# Altium schematic sheet power.SchDoc: Project Title
size A3; ApprovedBy: Yves Chevallier; CheckedBy: Yves Chevallier; Author: Yves Chevallier; CompanyName: EPFL; DrawnBy: Yves Chevallier; Engineer: Yves Chevallier; Organization: EPFL; Address1: EPFL; Address2: CH1015 Lausanne; Address3: +41(0)21 693 36 98; Address4: +41(0)21 693 26 00; DocumentNumber: ABC.00.0000.000.0; Revision: v1.0; SheetNumber: 0; SheetTotal: 0; DrawnByDate: 2000-01-01; ExecutionWarrantDate: 2000-01-01; ExecutionWarrant: Yves Chevallier; Context: Confidential; PageSetup: Record=PageOptions|CenterHorizontal=True|CenterVertical=False|PrintScale=0.97|XCorrection=1.00|YCorrection=1.00|PrintKind=0|BorderSize=5000000|LeftOffset=0|BottomOffset=0|Orientation=2|PaperLength=1000|PaperWidth=1000|Scale=100|PaperSource=262|PrintQuality=600|MediaType=1|DitherType=10|PaperKind=A4|PrintScaleMode=1; EngineerDate: 2000-01-01; CheckedByDate: 2000-01-01; ProjectName: PRJ
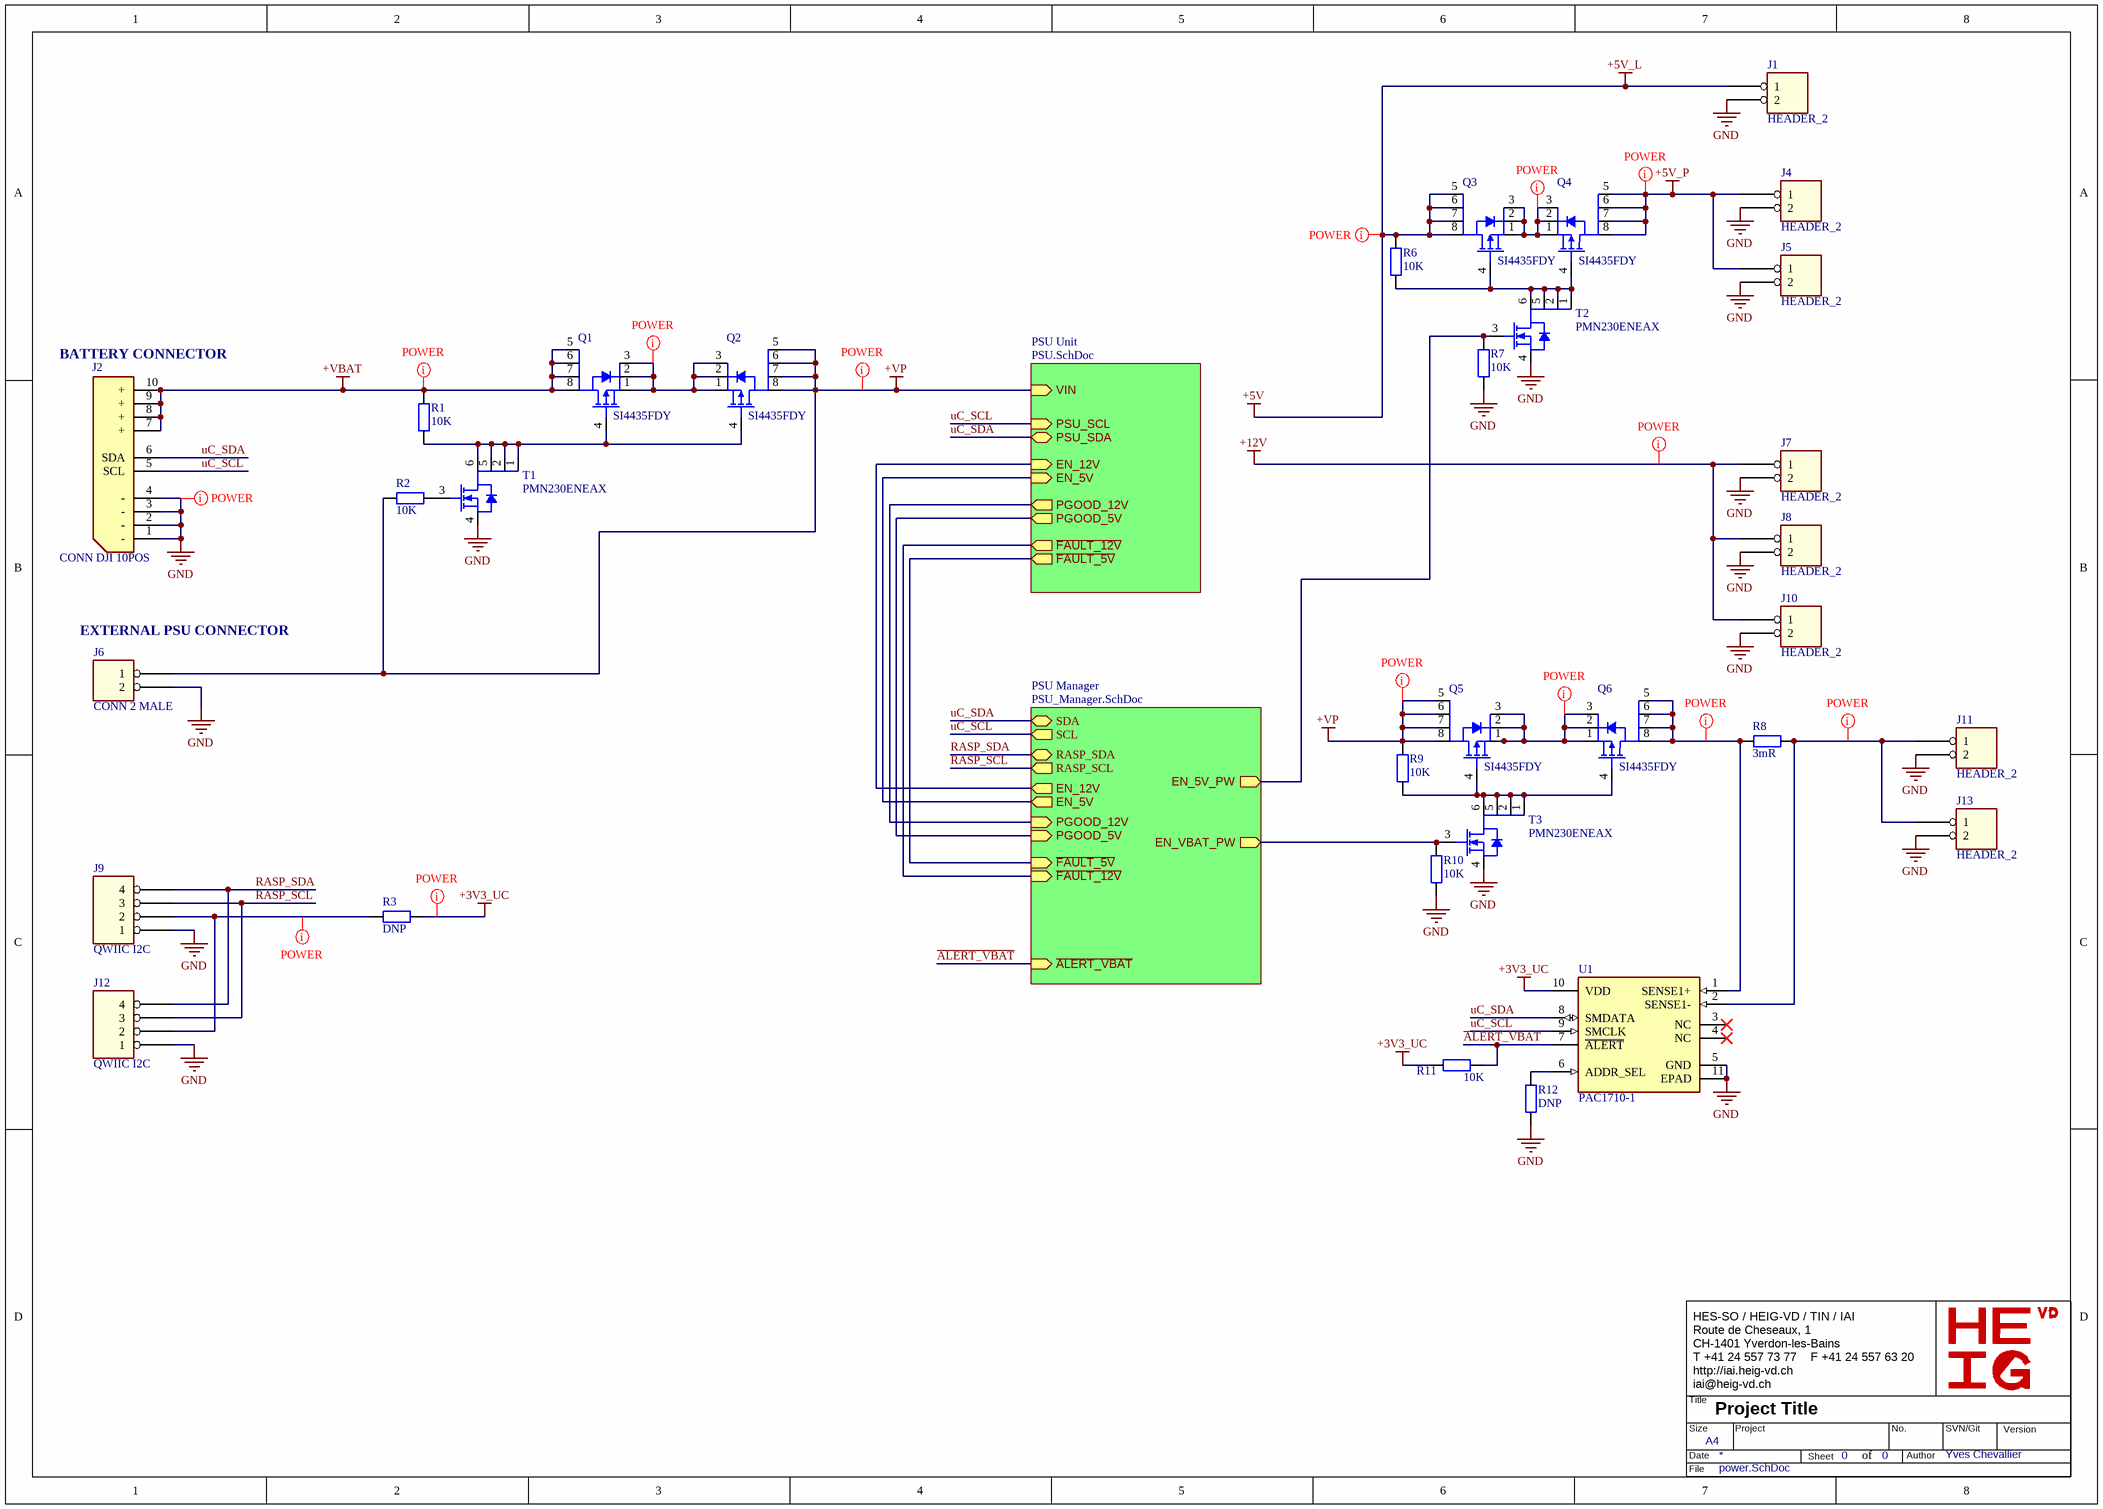
[diagram p0: power.SchDoc]

## Parts
J1  HEADER_2  [PHOENIX MKDS 5/2-6,35 - 1714955]
J2  CONN DJI 10POS  [DJI Battery Connector]
J4  HEADER_2  [PHOENIX MKDS 5/2-6,35 - 1714955]
J5  HEADER_2  [PHOENIX MKDS 5/2-6,35 - 1714955]
J6  CONN 2 MALE  [PHOENIX MKDS 5/2-6,35 - 1714955]
J7  HEADER_2  [PHOENIX MKDS 5/2-6,35 - 1714955]
J8  HEADER_2  [PHOENIX MKDS 5/2-6,35 - 1714955]
J9  QWIIC I2C  [JST_SM04B-SRSS-TB(LF)(SN)]
J10  HEADER_2  [PHOENIX MKDS 5/2-6,35 - 1714955]
J11  HEADER_2  [PHOENIX MKDS 5/2-6,35 - 1714955]
J12  QWIIC I2C  [JST_SM04B-SRSS-TB(LF)(SN)]
J13  HEADER_2  [PHOENIX MKDS 5/2-6,35 - 1714955]
Q1  SI4435FDY  [SOIC-8 - N]
Q2  SI4435FDY  [SOIC-8 - N]
Q3  SI4435FDY  [SOIC-8 - N]
Q4  SI4435FDY  [SOIC-8 - N]
Q5  SI4435FDY  [SOIC-8 - N]
Q6  SI4435FDY  [SOIC-8 - N]
R1  10K  [SM/R_0603]
R2  10K  [SM/R_0603]
R3  DNP  [SM/R_0603]  (no BOM)
R6  10K  [SM/R_0603]
R7  10K  [SM/R_0603]
R8  3mR  [SM/R_1210]
R9  10K  [SM/R_0603]
R10  10K  [SM/R_0603]
R11  10K  [SM/R_0603]
R12  DNP  [SM/R_0603]  (no BOM)
T1  PMN230ENEAX  [TSOP-6]
T2  PMN230ENEAX  [TSOP-6]
T3  PMN230ENEAX  [TSOP-6]
U1  PAC1710-1  [WFDFN-10]

## Sub-sheets
PSU Manager = PSU_Manager.SchDoc: SDA (bidir), SCL (out), EN_5V (out), PGOOD_12V (in), PGOOD_5V (in), EN_12V (out), ~{FAULT_12V} (in), ~{FAULT_5V} (in), EN_VBAT_PW (out), EN_5V_PW (out), ~{ALERT_VBAT} (in), RASP_SDA (bidir), RASP_SCL (out)
PSU Unit = PSU.SchDoc: VIN (in), PSU_SCL (in), EN_5V (in), PGOOD_12V (out), PSU_SDA (bidir), PGOOD_5V (out), EN_12V (in), ~{FAULT_12V} (out), ~{FAULT_5V} (out)

## Nets
+3V3_UC: R3.1 R11.1 U1.10(VDD)
+5V: J1.1 Q3.5(D) Q3.6(D) Q3.7(D) Q3.8(D) R6.1  [also labelled +5V_L]
+5V_P: J4.1 J5.1 Q4.5(D) Q4.6(D) Q4.7(D) Q4.8(D)
+12V: J7.1 J8.1 J10.1
+VBAT: J2.7(+) J2.8(+) J2.9(+) J2.10(+) Q1.5(D) Q1.6(D) Q1.7(D) Q1.8(D) R1.1
+VP: J6.1 Q2.5(D) Q2.6(D) Q2.7(D) Q2.8(D) Q5.5(D) Q5.6(D) Q5.7(D) Q5.8(D) R2.1 R9.1 ; sheet PSU Unit/VIN
GND: J1.2 J2.1(-) J2.2(-) J2.3(-) J2.4(-) J4.2 J5.2 J6.2 J7.2 J8.2 J9.1 J10.2 J11.2 J12.1 J13.2 R7.1 R10.1 R12.2 T1.4(S) T2.4(S) T3.4(S) U1.5(GND) U1.11(EPAD)
~{ALERT_VBAT}: R11.2 U1.7(~{ALERT}) ; sheet PSU Manager/~{ALERT_VBAT}
RASP_SCL: J9.3 J12.3 ; sheet PSU Manager/RASP_SCL
RASP_SDA: J9.4 J12.4 ; sheet PSU Manager/RASP_SDA
uC_SCL: J2.5(SCL) U1.9(SMCLK) ; sheet PSU Unit/PSU_SCL, sheet PSU Manager/SCL
uC_SDA: J2.6(SDA) U1.8(SMDATA) ; sheet PSU Unit/PSU_SDA, sheet PSU Manager/SDA
NetJ9_2: J9.2 J12.2 R3.2
NetJ11_1: J11.1 J13.1 R8.2 U1.2(SENSE1-)
NetQ1_1: Q1.1(S) Q1.2(S) Q1.3(S) Q2.1(S) Q2.2(S) Q2.3(S)
NetQ1_4: Q1.4(G) Q2.4(G) R1.2 T1.1(D) T1.2(D) T1.5(D) T1.6(D)
NetQ3_1: Q3.1(S) Q3.2(S) Q3.3(S) Q4.1(S) Q4.2(S) Q4.3(S)
NetQ3_4: Q3.4(G) Q4.4(G) R6.2 T2.1(D) T2.2(D) T2.5(D) T2.6(D)
NetQ5_1: Q5.1(S) Q5.2(S) Q5.3(S) Q6.1(S) Q6.2(S) Q6.3(S)
NetQ5_4: Q5.4(G) Q6.4(G) R9.2 T3.1(D) T3.2(D) T3.5(D) T3.6(D)
NetQ6_5: Q6.5(D) Q6.6(D) Q6.7(D) Q6.8(D) R8.1 U1.1(SENSE1+)
NetR2_2: R2.2 T1.3(G)
NetR7_2: R7.2 T2.3(G) ; sheet PSU Manager/EN_5V_PW
NetR10_2: R10.2 T3.3(G) ; sheet PSU Manager/EN_VBAT_PW
NetR12_1: R12.1 U1.6(ADDR_SEL)
(unnamed): sheet PSU Unit/EN_5V, sheet PSU Manager/EN_5V
(unnamed): sheet PSU Unit/PGOOD_12V, sheet PSU Manager/PGOOD_12V
(unnamed): sheet PSU Unit/PGOOD_5V, sheet PSU Manager/PGOOD_5V
(unnamed): sheet PSU Unit/EN_12V, sheet PSU Manager/EN_12V
(unnamed): sheet PSU Unit/~{FAULT_12V}, sheet PSU Manager/~{FAULT_12V}
(unnamed): sheet PSU Unit/~{FAULT_5V}, sheet PSU Manager/~{FAULT_5V}

Not connected (* = marked no-connect by the designer): U1 3(NC)* 4(NC)*

## Layout directives
net class POWER_CLASS: +3V3_UC, +5V, +5V_P, +12V, +VBAT, +VP, GND, NetJ9_2, NetJ11_1, NetQ1_1, NetQ3_1, NetQ5_1, NetQ6_5

## Notes on the sheet
- (near J2) BATTERY CONNECTOR
- (near J6) EXTERNAL PSU CONNECTOR
- HES-SO / HEIG-VD / TIN / IAI
  Route de Cheseaux, 1
  CH-1401 Yverdon-les-Bains
  T +41 24 557 73 77    F +41 24 557 63 20
  http://iai.heig-vd.ch
  iai@heig-vd.ch
- Title
- Size
- Date
- A4
- Project
- Sheet
- of
- No.
- Author
- SVN/Git
- Version
- File

## Library data of the parts
J9 J12 = QWIIC I2C: Manufacturer: SparkFun Electronics; Manufacturer P/N: PRT-14417; Supplier 1: Digikey; Supplier 2: Mouser; Supplier Part Number 1: PRT-14417-ND; Supplier Part Number 2: 474-PRT-14417
Q1-Q6 = MOSFET P-CH 30V 12.6A 8SOIC: Manufacturer Name: Nexperia; Supplier 1: Digikey; Supplier 2: Mouser; Supplier Part Number 1: SI4435FDY-T1-GE3CT-ND; Supplier Part Number 2: 78-SI4435FDY-T1-GE3; Value: SI4435FDY
R1 R2 R6 R7 R9-R11 = RES SMD 10K OHM 1% 1/10W 0603: Résistance 0603 100mW 1% 10K; Manufacturer: Yageo; Manufacturer P/N: RC0603FR-0710KL; Voltage: 75V; Value: 10K; Power: 100mW; Tolerance: 1%; Supplier 1: Digikey; Supplier Part Number 1: 311-10.0KHRCT-ND; ComponentLink1Description: Datasheet; ComponentLink1URL: https://www.yageo.com/upload/media/product/productsearch/datasheet/rchip/PYu-RC_Group_51_RoHS_L_11.pdf; ComponentLink2Description: Supplier; ComponentLink2URL: https://www.digikey.ch/product-detail/fr/yageo/RC0603FR-0710KL/311-10-0KHRCT-ND/729827; Supplier 2: Mouser; Supplier Part Number 2: 603-RC0603FR-0710KL
R3 R12 = RES SMD DNP JUMPER 1/10W 0603: Value: DNP; ComponentLink1Description: Datasheet; ComponentLink2Description: Supplier
R8 = RES 0.003 OHM 5% 1W 1210: Manufacturer: Rohm; Manufacturer P/N: PMR25HZPJV3L0; Voltage: 75V; Value: 3mR; Power: 1W; Tolerance: 5%; Supplier 1: Digikey; Supplier Part Number 1: RHM.003AQCT-ND; Supplier 2: Mouser; Supplier Part Number 2: 755-PMR25HZPJV3L0
T1-T3 = MOSFET N-CH 60V 1.8A 6TSOP: Manufacturer Name: Nexperia; Supplier 1: Digikey; Supplier 2: Mouser; Supplier Part Number 1: 1727-8649-1-ND; Supplier Part Number 2: 771-PMN230ENEAX; Value: PMN230ENEAX
U1 = IC CURRENT SENSE MON SGL 10VDFN: Manufacturer: Microchip; Manufacturer P/N: PAC1710-1-AIA-TR; Value: PAC1710-1; Supplier 1: Digikey; Supplier 2: Mouser; Supplier Part Number 1: PAC1710-1-AIA-CT-ND; Supplier Part Number 2: 579-PAC1710-1-AIA-TR